# EAGLE schematic ethernet_poe (EAGLE 9.6.2)
REVISION: 1.0; TEAM: RoboRacing
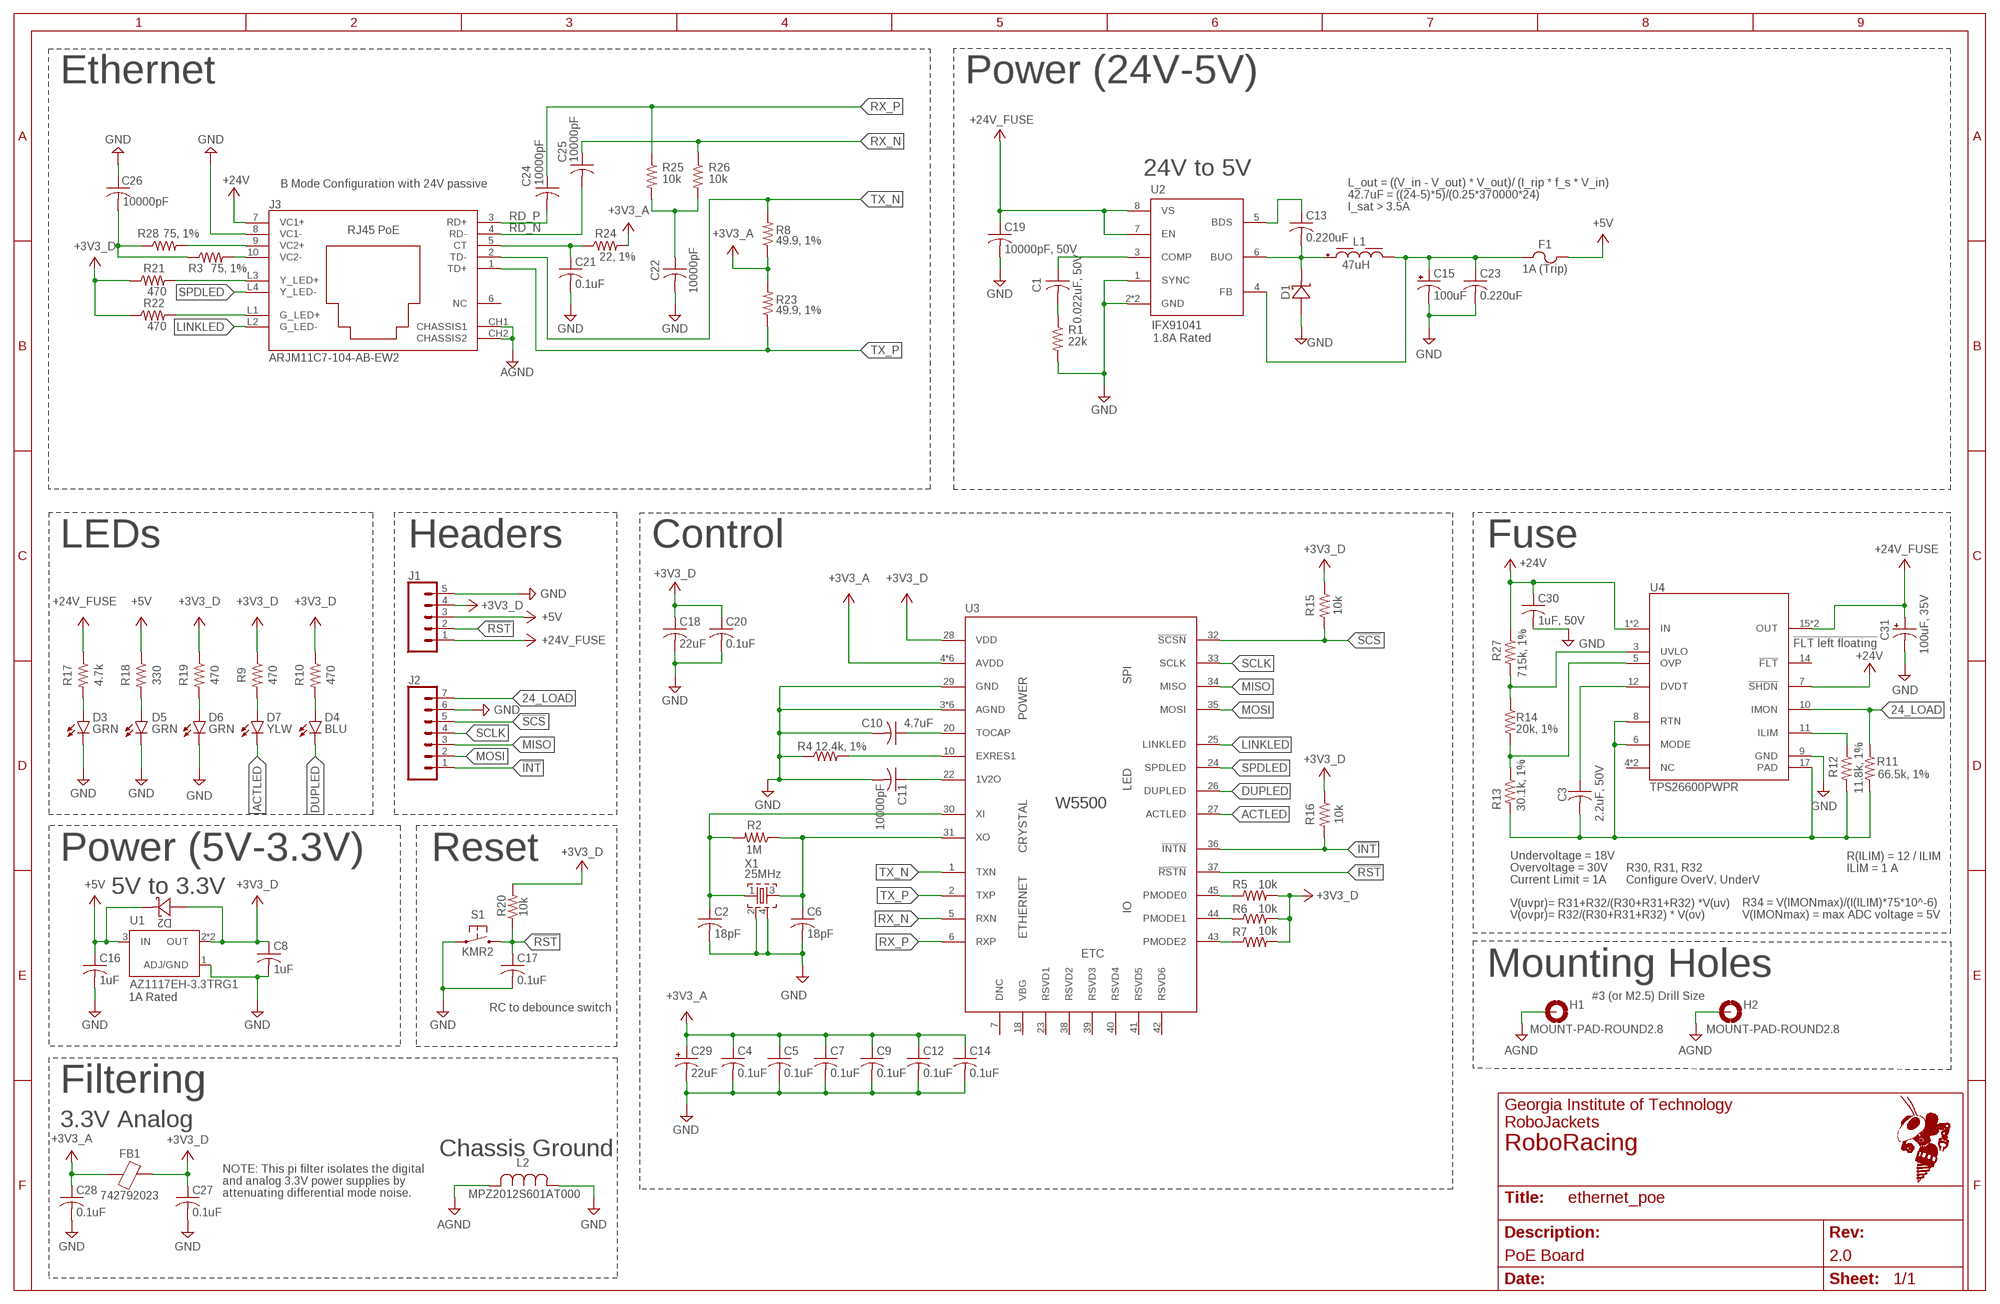
[diagram p0: schematic, sheet 1]
FRAME1 (FRAME_11_17): REVISION: 2.0; SCH_DESC: PoE Board; TEAM: RoboRacing

## Parts
C1  0.022uF, 50V  C-USC0603  [C0603]
C2  18pF  C-USC0603  [C0603]
C3  2.2uF, 50V  C-USC0603  [C0603]
C4  0.1uF  C-USC0402  [C0402]
C5  0.1uF  C-USC0402  [C0402]
C6  18pF  C-USC0603  [C0603]
C7  0.1uF  C-USC0402  [C0402]
C8  1uF  C-USC0603  [C0603]
C9  0.1uF  C-USC0402  [C0402]
C10  4.7uF  C-USC0603  [C0603]
C11  10000pF  C-USC0402  [C0402]
C12  0.1uF  C-USC0402  [C0402]
C13  0.220uF  C-USC0603  [C0603]
C14  0.1uF  C-USC0402  [C0402]
C15  100uF  CPOL-USE2-5  [E2-5]
C16  1uF  C-USC0603  [C0603]
C17  0.1uF  C-USC0402  [C0402]
C18  22uF  C-USC0603  [C0603]
C19  10000pF, 50V  C-USC0603  [C0603]
C20  0.1uF  C-USC0402  [C0402]
C21  0.1uF  C-USC0402  [C0402]
C22  10000pF  C-USC0603  [C0603]
C23  0.220uF  C-USC0603  [C0603]
C24  10000pF  C-USC0402  [C0402]
C25  10000pF  C-USC0402  [C0402]
C26  10000pF  C-USC0603  [C0603]
C27  0.1uF  C-USC0603  [C0603]
C28  0.1uF  C-USC0603  [C0603]
C29  22uF  22UF-POLAR-PANASONIC_C-35V-20%  [PANASONIC_C]
C30  1uF, 50V  C-USC0603  [C0603]
C31  100uF, 35V  CPOL-USE2.5-7  [E2,5-7]
D1  NTS260ESFT3G  [SOD123FL_DIO]
D2  NTS260ESFT3G  [SOD123FL_DIO]
D3  GRN  LEDCHIP-LED0603  [CHIP-LED0603]
D4  BLU  LEDCHIP-LED0603  [CHIP-LED0603]
D5  GRN  LEDCHIP-LED0603  [CHIP-LED0603]
D6  GRN  LEDCHIP-LED0603  [CHIP-LED0603]
D7  YLW  LEDCHIP-LED0603  [CHIP-LED0603]
F1  1A (Trip)  0ZCG0050AF2C  [0ZCG_BEL]
FB1  742792023  [0805]
H1  MOUNT-PAD-ROUND2.8  [2,8-PAD]
H2  MOUNT-PAD-ROUND2.8  [2,8-PAD]
J1  CONN_05  [1X05]
J2  CONN_07  [1X07]
J3  ARJM11C7-104-AB-EW2  [CONN_EW_ABR]
L1  47uH  7447709470_7447709470  [WE-PD_1210]
L2  MPZ2012S601AT000  [IND_2012_TDK]
R1  22k  R-US_R0603  [R0603]
R2  1M  R-US_R0402  [R0402]
R3  75, 1%  R-US_R0603  [R0603]
R4  12.4k, 1%  R-US_R0603  [R0603]
R5  10k  R-US_R0603  [R0603]
R6  10k  R-US_R0603  [R0603]
R7  10k  R-US_R0603  [R0603]
R8  49.9, 1%  R-US_R0402  [R0402]
R9  470  R-US_R0603  [R0603]
R10  470  R-US_R0603  [R0603]
R11  66.5k, 1%  R-US_R0603  [R0603]
R12  11.8k, 1%  R-US_R0603  [R0603]
R13  30.1k, 1%  R-US_R0603  [R0603]
R14  20k, 1%  R-US_R0603  [R0603]
R15  10k  R-US_R0603  [R0603]
R16  10k  R-US_R0603  [R0603]
R17  4.7k  R-US_R0603  [R0603]
R18  330  R-US_R0603  [R0603]
R19  470  R-US_R0603  [R0603]
R20  10k  R-US_R0603  [R0603]
R21  470  R-US_R0603  [R0603]
R22  470  R-US_R0603  [R0603]
R23  49.9, 1%  R-US_R0402  [R0402]
R24  22, 1%  R-US_R0603  [R0603]
R25  10k  R-US_R0603  [R0603]
R26  10k  R-US_R0603  [R0603]
R27  715k, 1%  R-US_R0603  [R0603]
R28  75, 1%  R-US_R0603  [R0603]
S1  KMR2  [KMR2]
U1  AZ1117EH-3.3TRG1  [SOT230P700X180-4N]
U2  IFX91041  [SOIC-8-EXPOSED_PAD]
U3  W5500  [48-LQFP]
U4  TPS26600PWPR  [PWP0016H_N]
X1  25MHz  ABM10W-25.0000MHZ-6-K1Z-T3  [OSCILLATOR-SMD-2.5X2]

## Nets
3V3_LED: D6.A R19.2
3V3_LED1: D7.A R9.2
3V3_LED2: D4.A R10.2
5V_LED: D5.A R18.2
5V_RAW: C13.2 D1.1 L1.1 U2.6(BUO)
24_LOAD: J2.7 R11.1 U4.10(IMON)
24V_LED: D3.A R17.2
!INT [spi]: J2.1 R16.2 U3.36(!INTN)
!RST: C17.1 J1.2 R20.1 S1.2.1 S1.2.2 U3.37(!RSTN)
!SCS [spi]: J2.5 R15.2 U3.32(!SCSN)
+3V3_A: C4.1 C5.1 C7.1 C9.1 C12.1 C14.1 C28.1 C29.+ FB1.1 R8.1 R23.2 R24.2 U3.4(AVDD) U3.8(AVDD) U3.11(AVDD) U3.15(AVDD) U3.17(AVDD) U3.21(AVDD)
+3V3_D [power]: C8.1 C18.1 C20.1 C27.1 D2.2 FB1.2 J1.4 R5.2 R6.2 R7.2 R9.1 R10.1 R15.1 R16.1 R19.1 R20.2 R21.1 R22.1 U1.2(OUT) U1.4(OUT) U3.28(VDD)
+5V: C16.1 D2.1 F1.2 J1.3 R18.1 U1.3(IN)
+5V_PREFUSE: C15.+ C23.1 F1.1 L1.2 U2.4(FB)
+24V: C30.1 J3.7(VC1+) R27.1 U4.1(IN) U4.2(IN) U4.7(!SHDN)
+24V_FUSE: C19.1 C31.+ J1.1 R17.1 U2.7(EN) U2.8(VS) U4.15(OUT) U4.16(OUT)
ACTLED: D7.C U3.27(ACTLED)
AGND: H1.B2,8(MOUNT) H2.B2,8(MOUNT) J3.CH1(CHASSIS1) J3.CH2(CHASSIS2) L2.2
CT: C21.1 J3.5(CT) R24.1
DUPLED: D4.C U3.26(DUPLED)
G_LED+: J3.L1(G_LED+) R22.2
GND [ethernet]: C2.2 C4.2 C5.2 C6.2 C7.2 C8.2 C9.2 C10.2 C11.2 C12.2 C14.2 C15.- C16.2 C17.2 C18.2 C19.2 C20.2 C21.2 C22.2 C23.2 C26.1 C27.2 C28.2 C29.- C30.2 C31.- D1.2 D3.C D5.C D6.C J1.5 J2.6 J3.8(VC1-) L2.1 R1.2 R4.1 S1.1.1 S1.1.2 U1.1(ADJ/GND) U2.1(SYNC) U2.2(GND) U2.9(GND) U3.3(AGND) U3.9(AGND) U3.14(AGND) U3.16(AGND) U3.19(AGND) U3.29(GND) U3.48(AGND) U4.9(GND) X1.2(SHD1) X1.4(SHD2)
LINKLED: J3.L2(G_LED-) U3.25(LINKLED)
MISO [spi]: J2.3 U3.34(MISO)
MOSI [spi]: J2.2 U3.35(MOSI)
N$4: R5.1 U3.45(PMODE0)
N$5: R6.1 U3.44(PMODE1)
N$7: R7.1 U3.43(PMODE2)
N$8: J3.9(VC2+) R28.2
N$9: R14.1 R27.2 U4.3(UVLO)
N$10: J3.10(VC2-) R3.2
N$11: C6.1 R2.1 U3.31(XO) X1.3(OUT)
N$12: C26.2 R3.1 R28.1
N$13: C2.1 R2.2 U3.30(XI) X1.1(IN)
N$15: C13.1 U2.5(BDS)
N$16: C1.2 R1.1
N$17: C1.1 U2.3(COMP)
N$18: C11.1 U3.22(1V2O)
N$19: C10.1 U3.20(TOCAP)
N$21: R4.2 U3.10(EXRES1)
N$27: R13.1 R14.2 U4.5(OVP)
N$28: C3.1 U4.12(DVDT)
N$33 [power]: R12.1 U4.11(ILIM)
RD_N [ethernet]: C25.2 J3.4(RD-)
RD_P [ethernet]: C24.2 J3.3(RD+)
RTN: C3.2 R11.2 R12.2 R13.2 U4.6(MODE) U4.8(RTN) U4.17(PAD)
RX_FILTER: C22.1 R25.2 R26.2
RX_N [ethernet]: C25.1 R26.1 U3.5(RXN)
RX_P [ethernet]: C24.1 R25.1 U3.6(RXP)
SCLK [spi]: J2.4 U3.33(SCLK)
SPDLED: J3.L4(Y_LED-) U3.24(SPDLED)
TX_N [ethernet]: J3.2(TD-) R8.2 U3.1(TXN)
TX_P [ethernet]: J3.1(TD+) R23.1 U3.2(TXP)
Y_LED+: J3.L3(Y_LED+) R21.2
Unconnected: J3.6(NC) U3.7(DNC) U3.18(VBG) U3.23(RSVD1) U3.38(RSVD2) U3.39(RSVD3) U3.40(RSVD4) U3.41(RSVD5) U3.42(RSVD6) U4.4(NC) U4.13(NC) U4.14(!FLT)

## Notes on the sheet
- Ethernet | Power (24V-5V)
- 24V to 5V
- B Mode Configuration with 24V passive
- L_out = ((V_in - V_out) * V_out)/ (I_rip * f_s * V_in)
  42.7uF = ((24-5)*5)/(0.25*370000*24)
  I_sat > 3.5A
- 1.8A Rated
- LEDs | Headers | Control | Fuse
- !FLT left floating
- Power (5V-3.3V) | Reset
- R(ILIM) = 12 / ILIM
  ILIM = 1 A
- Undervoltage = 18V
  Overvoltage = 30V
  Current Limit = 1A
- R30, R31, R32 
  Configure OverV, UnderV
- 5V to 3.3V
- V(uvpr)= R31+R32/(R30+R31+R32) *V(uv)
- V(ovpr)= R32/(R30+R31+R32) * V(ov)
- R34 = V(IMONmax)/(I(ILIM)*75*10^-6)
  V(IMONmax) = max ADC voltage = 5V
- Mounting Holes
- 1A Rated | #3 (or M2.5) Drill Size
- RC to debounce switch
- Filtering
- 3.3V Analog
- Chassis Ground
- NOTE: This pi filter isolates the digital 
  and analog 3.3V power supplies by
  attenuating differential mode noise.

## Library data of the parts
C1-C3 C6 C8 C10 C13 C16 C18 C19 C22 C23 C26 C30 = rcl:C-US: CAPACITOR, American symbol; SPICEPREFIX: C
C4 C5 C7 C9 C11 C12 C14 C17 C20 C21 C24 C25 C27 C28 = adafruit:C-US: CAPACITOR, American symbol
C15 = rcl:CPOL-US: POLARIZED CAPACITOR, American symbol; DKPN: 732-8598-1-ND; SPICEPREFIX: C
C29 = SparkFun-Capacitors:22UF-POLAR: 22µF polarized capacitors A capacitor is a passive two-terminal electrical component used to store electrical energy temporarily in an electric field.; PROD_ID: CAP-08618
C31 = rcl:CPOL-US: POLARIZED CAPACITOR, American symbol; DKPN: 732-8942-1-ND; SPICEPREFIX: C
D1 D2 = ethernet_poe:NTS260ESFT3G: Diode Schottky 2A Surface Mount SOD-123FL; DKPN: NTS260ESFT3GOSCT-ND
D3-D7 = led:LED: LED OSRAM: - CHIPLED LG R971, LG N971, LY N971, LG Q971, LY Q971, LO R971, LY R971 LH N974, LH R974 LS Q976, LO Q976, LY Q976 LO Q996 - Hyper CHIPLED LW Q18S LB Q993, LB Q99A, LB R99A - SideLED LS A670, LO A670, LY A670, LG A670, LP A670 LB A673, LV A673, LT A673, LW A673 LH A674 LY A675 LS A676, LA A676, LO A676, LY A676, LW A676 LS A679, LY A679, LG A679 - Hyper Micro SIDELED® LS Y876, LA Y876, LO Y876, LY Y876 LT Y87S - SmartLED LW L88C, LW L88S LB L89C, LB L89S, LG L890 LS L89K, LO L89K, LY L89K LS L896, LA L896, LO L896, LY L896 - TOPLED LS T670, LO T670, LY T670, LG T670, LP T670 LSG T670, LSP T670, LSY T670, LOP T670, LYG T670 LG T671, LOG T671, LSG T671 LB T673, LV T673, LT T673, LW T673 LH T674 LS T676, LA T676, LO T676, LY T676, LB T676, LH T676, LSB T676, LW T676 LB T67C, LV T67C, LT T67C, LS T67K, LO T67K, LY T67K, LW E67C LS E67B, LA E67B, LO E67B, LY E67B, LB E67C, LV E67C, LT E67C LW T67C LS T679, LY T679, LG T679 LS T770, LO T770, LY T770, LG T770, LP T770 LB T773, LV T773, LT T773, LW T773 LH T774 LS E675, LA E675, LY E675, LS T675 LS T776, LA T776, LO T776, LY T776, LB T776 LHGB T686 LT T68C, LB T68C - Hyper Mini TOPLED® LB M676 - Mini TOPLED Santana® LG M470 LS M47K, LO M47K, LY M47K Source: http://www.osram.convergy.de LUXEON: - LUMILED® LXK2-PW12-R00, LXK2-PW12-S00, LXK2-PW14-U00, LXK2-PW14-V00 LXK2-PM12-R00, LXK2-PM12-S00, LXK2-PM14-U00 LXK2-PE12-Q00, LXK2-PE12-R00, LXK2-PE12-S00, LXK2-PE14-T00, LXK2-PE14-U00 LXK2-PB12-K00, LXK2-PB12-L00, LXK2-PB12-M00, LXK2-PB14-N00, LXK2-PB14-P00, LXK2-PB14-Q00 LXK2-PR12-L00, LXK2-PR12-M00, LXK2-PR14-Q00, LXK2-PR14-R00 LXK2-PD12-Q00, LXK2-PD12-R00, LXK2-PD12-S00 LXK2-PH12-R00, LXK2-PH12-S00 LXK2-PL12-P00, LXK2-PL12-Q00, LXK2-PL12-R00 Source: www.luxeon.com KINGBRIGHT: KA-3528ASYC Source: www.kingbright.com
F1 = ethernet_poe:0ZCG0050AF2C: Polymeric PTC Resettable Fuse 30V 1A Current Trip, 500mA Current Hold Surface Mount 1812 (4532 Metric), Concave; DKPN: 507-1762-1-ND
FB1 = ethernet_poe:742792023: 120 Ohms @ 100MHz 1 Signal Line Ferrite Bead 0805 (2012 Metric) 3A 30mOhm; DKPN: 732-1613-1-ND
H1 H2 = holes:MOUNT-PAD-ROUND: MOUNTING PAD, round
J1 = SparkFun-Connectors:CONN_05: Multi connection point. Often used as Generic Header-pin footprint for 0.1 inch spaced/style header connections On any of the 0.1 inch spaced packages, you can populate with these: Break Away Headers - Straight <https://www.sparkfun.com/products/116> (PRT-00116) Break Away Male Headers - Right Angle <https://www.sparkfun.com/products/553> (PRT-00553) Female Headers <https://www.sparkfun.com/products/115> (PRT-00115) Break Away Headers - Machine Pin <https://www.sparkfun.com/products/117> (PRT-00117) Break Away Female Headers - Swiss Machine Pin <https://www.sparkfun.com/products/743> (PRT-00743) For SCREWTERMINALS and SPRING TERMINALS visit here: Screw Terimnals on SparkFun.com <https://www.sparkfun.com/search/results?term=Screw+Terminals> (5mm/3.5mm/2.54mm spacing) This device is also useful as a general connection point to wire up your design to another part of your project. Our various solder wires solder well into these plated through hole pads. Hook-Up Wire - Assortment (Stranded, 22 AWG) <https://www.sparkfun.com/products/11375> (PRT-11375) Hook-Up Wire - Assortment (Solid Core, 22 AWG) <https://www.sparkfun.com/products/11367> (PRT-11367) View the entire wire category on our website here <https://www.sparkfun.com/categories/141> Special notes: Molex polarized connector foot print use with SKU : PRT-08231 with associated crimp pins and housings. 1MM SMD Version SKU: PRT-10208
J2 = SparkFun-Connectors:CONN_07: Multi connection point. Often used as Generic Header-pin footprint for 0.1 inch spaced/style header connections On any of the 0.1 inch spaced packages, you can populate with these: Break Away Headers - Straight <https://www.sparkfun.com/products/116> (PRT-00116) Break Away Male Headers - Right Angle <https://www.sparkfun.com/products/553> (PRT-00553) Female Headers <https://www.sparkfun.com/products/115> (PRT-00115) Break Away Headers - Machine Pin <https://www.sparkfun.com/products/117> (PRT-00117) Break Away Female Headers - Swiss Machine Pin <https://www.sparkfun.com/products/743> (PRT-00743) For SCREWTERMINALS and SPRING TERMINALS visit here: Screw Terimnals on SparkFun.com <https://www.sparkfun.com/search/results?term=Screw+Terminals> (5mm/3.5mm/2.54mm spacing) This device is also useful as a general connection point to wire up your design to another part of your project. Our various solder wires solder well into these plated through hole pads. Hook-Up Wire - Assortment (Stranded, 22 AWG) <https://www.sparkfun.com/products/11375> (PRT-11375) Hook-Up Wire - Assortment (Solid Core, 22 AWG) <https://www.sparkfun.com/products/11367> (PRT-11367) View the entire wire category on our website here <https://www.sparkfun.com/categories/141> Special notes: Molex polarized connector foot print use with SKU : PRT-08231 with associated crimp pins and housings. 1MM SMD Version SKU: PRT-10208 NOTES ON THE VARIANTS LOCK and LOCK_LONGPADS... This footprint was designed to help hold the alignment of a through-hole component (i.e. 6-pin header) while soldering it into place. You may notice that each hole has been shifted either up or down by 0.005 of an inch from it's more standard position (which is a perfectly straight line). This slight alteration caused the pins (the squares in the middle) to touch the edges of the holes. Because they are alternating, it causes a "brace" to hold the component in place. 0.005 has proven to be the perfect amount of "off-center" position when using our standard breakaway headers. Although looks a little odd when you look at the bare footprint, once you have a header in there, the alteration is very hard to notice. Also,if you push a header all the way into place, it is covered up entirely on the bottom side.
J3 = ethernet_poe:ARJM11C7-104-AB-EW2: 1 Port RJ45 Magjack Connector Through Hole 10/100 Base-T, AutoMDIX, Power over Ethernet (PoE); DKPN: 535-14148-ND
L1 = ethernet_poe_v2.1:7447709470: WE-PD SMT Power Inductor Characteristics AECQ 200 Qualified Ultra low RDC and RAC Highest possible saturation current based on Ferrite Suitable for switching frequency up to 10MHz Temperature dependent parameter available on Redexpert Operating Temperature from -40°C to +125°C / +150°C Types WE-PD: Since always with low loss material, tight tolerances and high saturation behavior compared to other manufacturers in the market WE-PD Robust: Plastic base improves the mechanical stability and efficiency WE-PD Performance: MnZn core improves Saturation and RDC for highest efficiency Applications Switch Mode Power supplies from 0,1W up to 300W Integrated DC DC Converter Ideal for Switch Mode Power supplies with extreme high efficiency (>95%) <https://www.we-online.com/catalog/media/o14825v209%20Family_WE-PD.jpg> Details see: https://www.we-online.com/catalog/en/WE-PD/ Details see: https://katalog.we-online.com/en/pbs/WE-PD Updated by Yingchun,Shan 2019-07-25 2019 (C) Wurth Elektronik; DATASHEET-URL: https://www.we-online.com/catalog/datasheet/7447709470.pdf; DKPN: 732-1246-1-ND; FRES: 6.5MHz; IR: 3.8A; ISAT: 4.5A; MOUNT: SMT; PART-NUMBER: 7447709470; RDC-MAX: 60mOhm; RDC-TYP: 46mOhm; VERSION: Standard
L2 = POE:MPZ2012S601AT000; BUILT_BY: EMA_UL_Team; MANUFACTURER_PART_NUMBER: MPZ2012S601AT000; SOURCELIBRARY: TDK_2015_05_22; VENDOR: TDK
R1 R3-R7 R9-R22 R24-R28 = rcl:R-US_: RESISTOR, American symbol; SPICEPREFIX: R
R2 R8 R23 = adafruit:R-US_: RESISTOR, American symbol
S1 = RoboJackets-Switches:KMR2; FUNCTION: Reset
U1 = ethernet_poe:AZ1117EH-3.3TRG1: LDO Voltage Regulator 3.3V, 1A, Sot223; DKPN: AZ1117EH-3.3TRG1DICT-ND
U2 = ethernet_poe:IFX91041: 1.8A DC/DC Step-Down Voltage Regulator 5.0V, 3.3V, or Adjustable Output; DKPN: IFX91041EJV50XUMA1CT-ND
U3 = ethernet_poe:W5500: Chip to control 10/100 Ethernet and output data over SPI; DKPN: 1278-1021-ND
U4 = ethernet_poe:TPS26600PWPR; DKPN: 296-47292-1-ND
X1 = ethernet_poe_v2.1:ABM10W-25.0000MHZ-6-K1Z-T3: 25MHz ±10ppm Crystal 6pF 50 Ohms 4-SMD, No Lead; DKPN: 535-13730-1-ND

## Net classes
0 default: width 0.203 mm, drill 0.4 mm, clearance 0.203 mm
1 power: width 0.203 mm, drill 0.4 mm, clearance 0.203 mm to class 0, clearance 0.203 mm
2 ethernet: width 0.16 mm, drill 0.3 mm, clearance 0.152 mm
3 spi: width 0.207 mm, drill 0.35 mm